# EAGLE design shoe_board-1 (EAGLE 9.4.2)
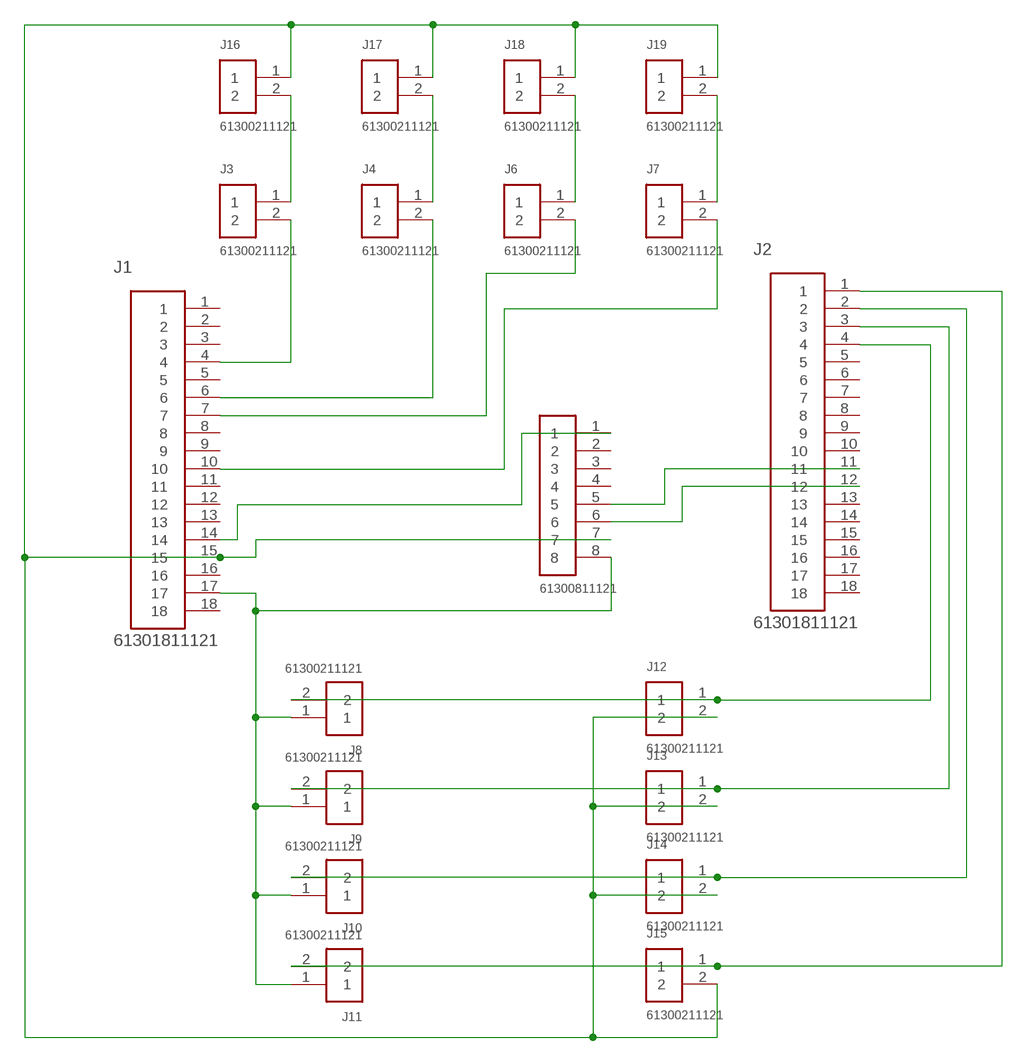
[diagram p0: schematic, sheet 1]

## Parts
J1  61301811121  [61301811121]
J2  61301811121  [61301811121]
J3  61300211121  [61300211121]
J4  61300211121  [61300211121]
J6  61300211121  [61300211121]
J7  61300211121  [61300211121]
J8  61300211121  [61300211121]
J9  61300211121  [61300211121]
J10  61300211121  [61300211121]
J11  61300211121  [61300211121]
J12  61300211121  [61300211121]
J13  61300211121  [61300211121]
J14  61300211121  [61300211121]
J15  61300211121  [61300211121]
J16  61300211121  [61300211121]
J17  61300211121  [61300211121]
J18  61300211121  [61300211121]
J19  61300211121  [61300211121]
J20  61300811121  [61300811121]

## Nets
N$1: J1.4 J3.2
N$2: J1.6 J4.2
N$3: J1.7 J6.2
N$4: J1.10 J7.2
N$5: J3.1 J16.2
N$6: J4.1 J17.2
N$7: J6.1 J18.2
N$8: J7.1 J19.2
N$9: J2.11 J20.5
N$10: J1.15 J12.2 J13.2 J14.2 J15.2 J16.1 J17.1 J18.1 J19.1 J20.7
N$11: J2.1 J11.2 J15.1
N$12: J2.2 J10.2 J14.1
N$13: J2.3 J9.2 J13.1
N$14: J2.4 J8.2 J12.1
N$15: J1.14 J20.1
N$16: J2.12 J20.6
N$19: J1.17 J8.1 J9.1 J10.1 J11.1 J20.8
Unconnected: J1.1 J1.2 J1.3 J1.5 J1.8 J1.9 J1.11 J1.12 J1.13 J1.16 J1.18 J2.5 J2.6 J2.7 J2.8 J2.9 J2.10 J2.13 J2.14 J2.15 J2.16 J2.17 J2.18 J20.2 J20.3 J20.4

## Library data of the parts
J1 J2 = Headers:61301811121: CONN HEADER VERT 18POS 2.54MM Manufacturer's datasheet <https://katalog.we-online.de/em/datasheet/6130xx11121.pdf>; CREATED_BY: PCBLayout.com; DIGIKEY_PART_NUMBER: 732-5328-ND; MANUFACTURER: Wurth Electronics Inc.; MPN: 61301811121
J3 J4 J6-J19 = Headers:61300211121: CONN HEADER VERT 2POS 2.54MM Manufacturer's datasheet <https://katalog.we-online.de/em/datasheet/6130xx11121.pdf>; CREATED_BY: PCBLayout.com; DIGI_KEY_PART_NUMBER: 732-5315-ND; MANUFACTURER: Wurth Electronics Inc.; MPN: 61300211121
J20 = Headers:61300811121: CONN HEADER VERT 8POS 2.54MM Manufacturer's datasheet <https://katalog.we-online.de/em/datasheet/6130xx11121.pdf>; CREATED_BY: PCBLayout.com; DIGI_KEY_PART_NUMBER: 732-5321-ND; MANUFACTURER: Wurth Electronics Inc.; MPN: 61300811121

## Board
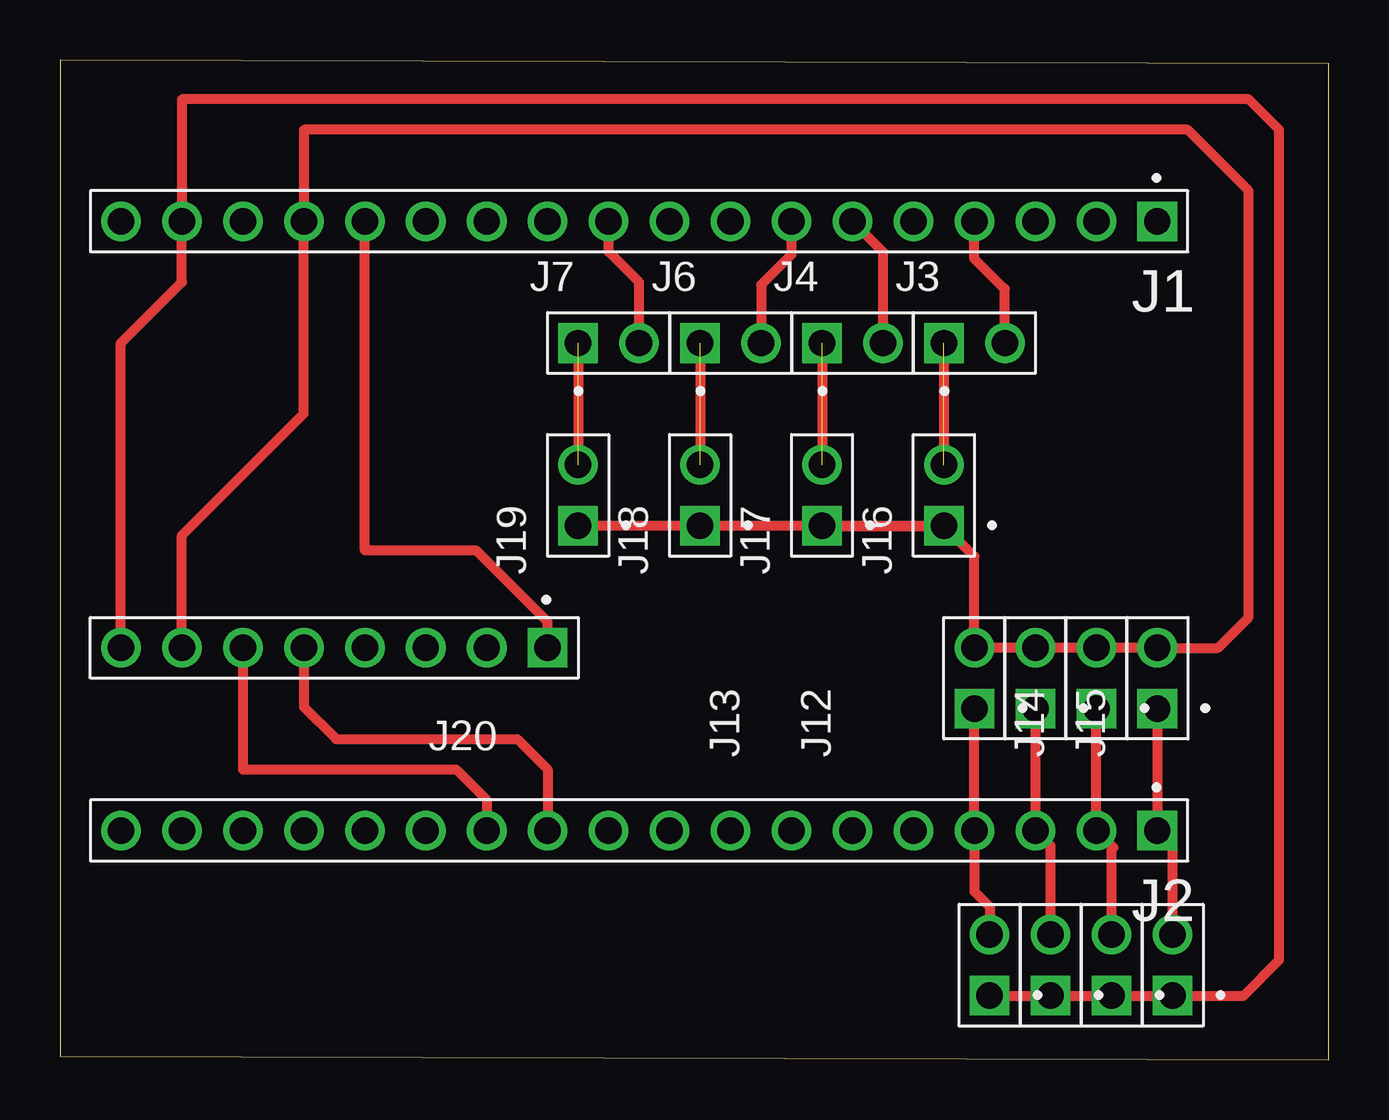
[diagram p1: board, top side]

Size 52.87 x 41.68 mm. Coordinates in mm from the lower left corner, seen from the top.
Outline: 0,0.15 52.87,0 52.87,41.53 0,41.68 0,0.15
Copper layers (1*16): Top 0.035mm / dielectric 1.5mm / Bottom 0.035mm
Design rules "OthermillDRC_1_32_v2": minimum track width 8mil, minimum drill 0.8mm, track to track 0.794003125mm, track to pad 0.794003125mm, pad to pad 0.794003125mm, via to via 0.794003125mm, smd to smd 0mil, copper to edge 0mil, drill to drill 1mil, minimum pad ring 10mil, minimum via ring 10mil, stop-mask expansion 1mil, vias tented up to drill 30mil, thermal gap 10mil

### Footprints (pad centres in the part's own frame; a part is rotated, then mirrored left to right if it is on the bottom)
61301811121 = drill 1.1 square: 1 -21.59,0 | drill 1.1: 2 -19.05,0; 3 -16.51,0; 4 -13.97,0; 5 -11.43,0; 6 -8.89,0; 7 -6.35,0; 8 -3.81,0; 9 -1.27,0; 10 1.27,0; 11 3.81,0; 12 6.35,0; 13 8.89,0; 14 11.43,0; 15 13.97,0; 16 16.51,0; 17 19.05,0; 18 21.59,0
61300211121 = drill 1.1 square: 1 -1.27,0 | drill 1.1: 2 1.27,0
61300811121 = drill 1.1 square: 1 -8.89,0 | drill 1.1: 2 -6.35,0; 3 -3.81,0; 4 -1.27,0; 5 1.27,0; 6 3.81,0; 7 6.35,0; 8 8.89,0

### Placement (x,y rotation side)
J1  24.13,34.96 180 top
J2  24.13,9.56 180 top
J3  38.1,29.88 0 top
J4  33.02,29.88 0 top
J6  27.94,29.88 0 top
J7  22.86,29.88 0 top
J8  38.74,3.95 90 top
J9  41.28,3.95 90 top
J10  43.82,3.95 90 top
J11  46.36,3.95 90 top
J12  38.1,15.91 90 top
J13  40.64,15.91 90 top
J14  43.18,15.91 90 top
J15  45.72,15.91 90 top
J16  36.83,23.53 90 top
J17  31.75,23.53 90 top
J18  26.67,23.53 90 top
J19  21.59,23.53 90 top
J20  11.43,17.18 180 top

### Tracks (layer width: path | path; a pad name or v marks a point on that pad's centre or on a via)
N$1
  Top 0.406: J1.4 38.1,33.4 39.37,32.13 J3.2
N$2
  Top 0.406: J1.6 34.29,33.69 J4.2
N$3
  Top 0.406: J1.7 30.48,33.58 29.21,32.31 J6.2
N$4
  Top 0.406: J1.10 22.86,33.69 24.13,32.42 J7.2
N$5  (1 unrouted)
  Top 0.406: J3.1 J16.2
N$6  (1 unrouted)
  Top 0.406: J4.1 J17.2
N$7  (1 unrouted)
  Top 0.406: J6.1 J18.2
N$8  (1 unrouted)
  Top 0.406: J7.1 J19.2
N$9
  Top 0.406: J20.5 10.16,14.71 11.5,13.37 19.05,13.37 20.32,12.1 J2.11
N$10
  Top 0.203: J13.2 45.78,17.18
  Top 0.406: J16.1 J18.1 J19.1 | J16.1 38.1,20.99 J12.2 J15.2 | J15.2 45.78,17.18 | J15.2 48.26,17.18 49.53,18.45 49.53,36.23 46.99,38.77 10.16,38.77 J1.15 10.15,26.94 5.08,21.87 J20.7 | 39.67,17.18 J13.2 J14.2 | J17.1 J16.1
N$11
  Top 0.406: J15.1 J2.1 46.35,8.93 46.36,8.93 J11.2
N$12
  Top 0.406: J14.1 J2.2 43.9,8.85 43.82,8.76 J10.2
N$13
  Top 0.406: J13.1 J2.3 41.28,8.93 J9.2
N$14
  Top 0.406: J12.1 J2.4 38.1,7.02 38.74,6.39 J8.2
N$15
  Top 0.406: J1.14 12.7,21.25 17.32,21.25 20.32,18.26 J20.1
N$16
  Top 0.406: J20.6 7.62,12.1 16.51,12.1 17.78,10.83 J2.12
N$19
  Top 0.406: J20.8 2.54,29.88 5.08,32.42 J1.17 5.08,40.04 49.53,40.04 50.8,38.77 50.8,4.17 49.32,2.68 J11.1 J10.1 J9.1 J8.1